# EAGLE design Photon_Proto_Shield (EAGLE 7.1.0)
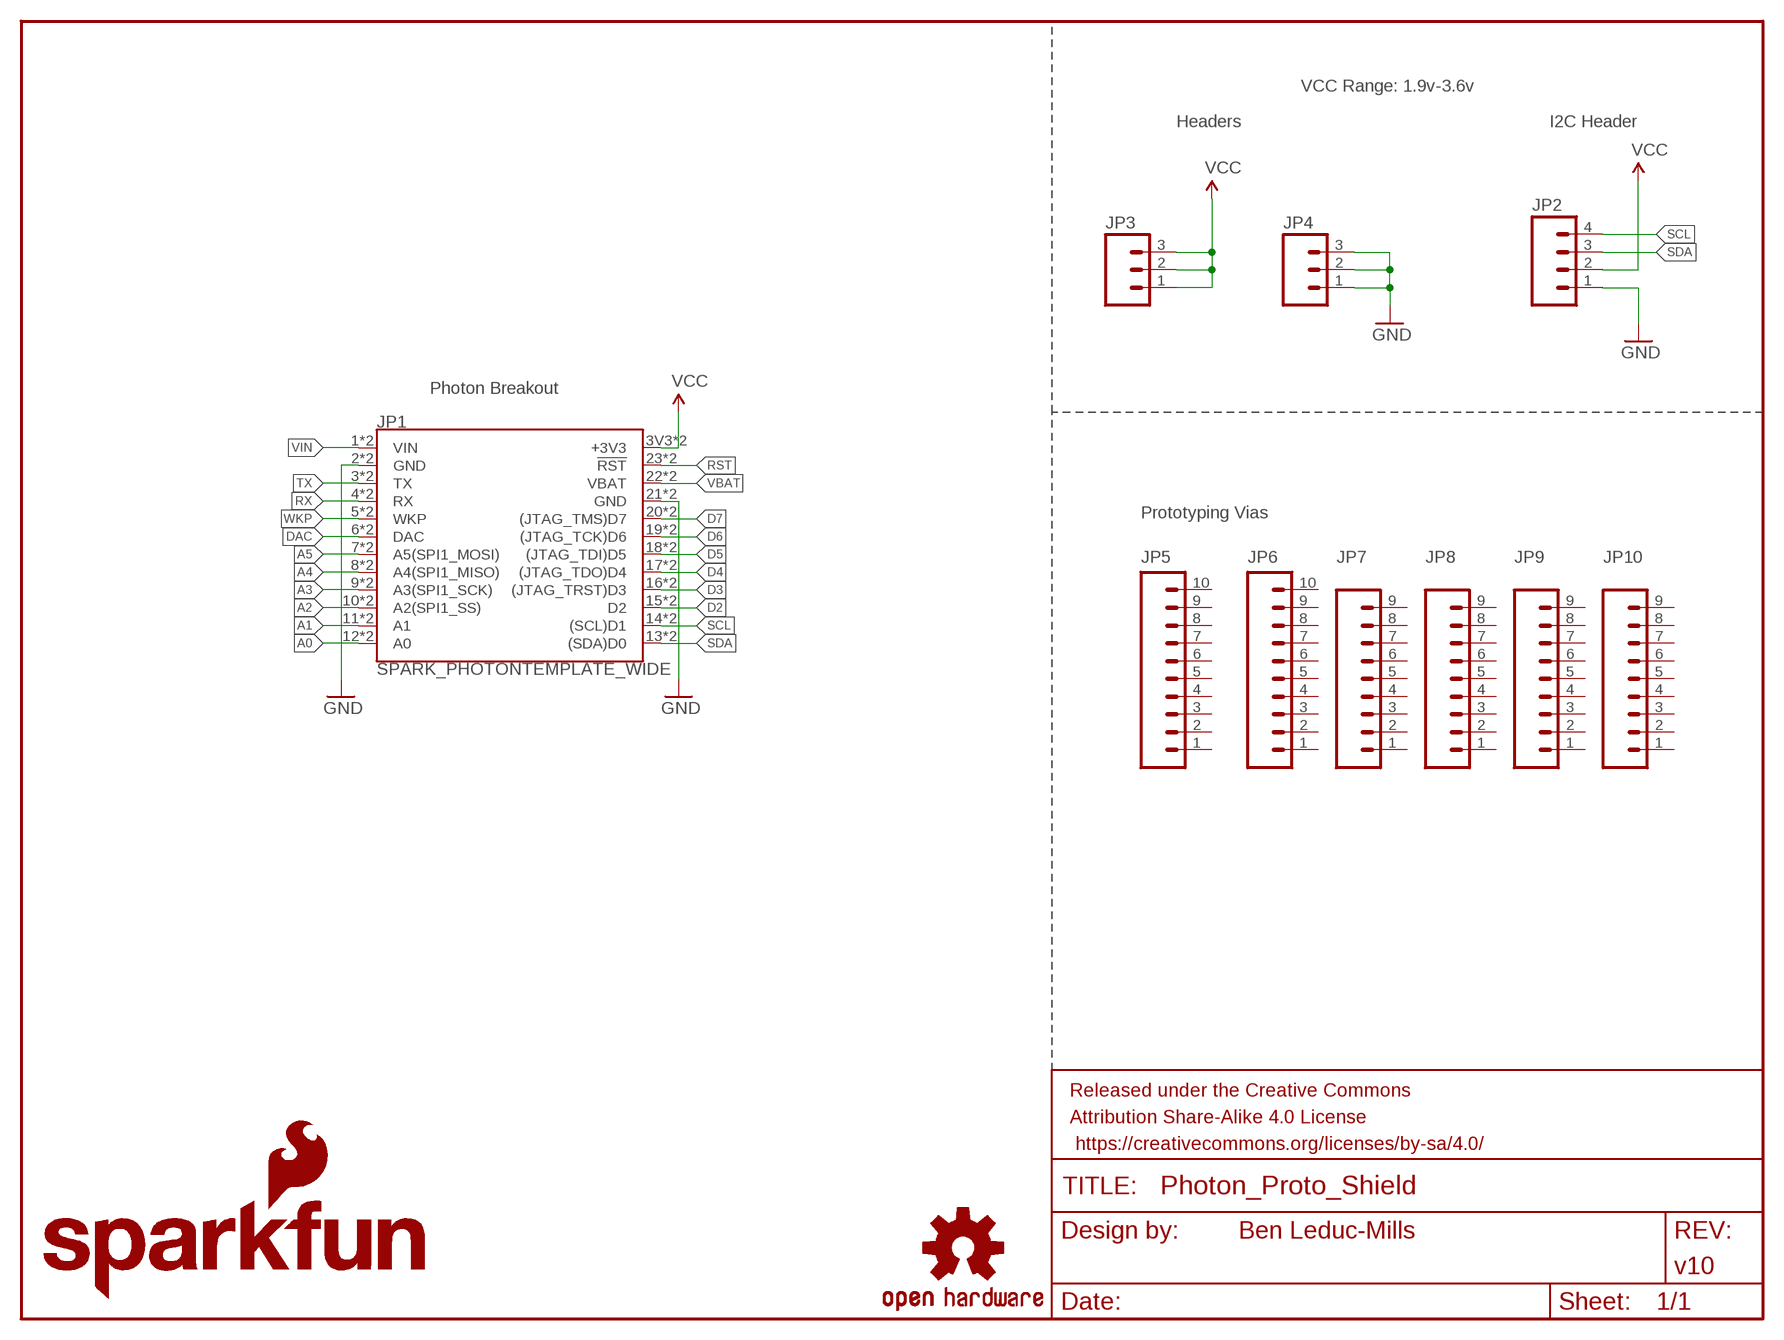
[diagram p0: schematic, sheet 1]

## Parts
FRAME1  FRAME-LETTER  [CREATIVE_COMMONS]
JP1  SPARK_PHOTONTEMPLATE_WIDE  [SPARK_PHOTON_TEMPLATE_WIDE]
JP2  M04PTH  [1X04]
JP3  M03PTH  [1X03]
JP4  M03PTH  [1X03]
JP5  M10NO_SILK_PTH_FEMALE  [1X10_NO_SILK]
JP6  M10NO_SILK_PTH_FEMALE  [1X10_NO_SILK]
JP7  M09NO_SILK  [1X09_NO_SILK]
JP8  M09NO_SILK  [1X09_NO_SILK]
JP9  M09NO_SILK  [1X09_NO_SILK]
JP10  M09NO_SILK  [1X09_NO_SILK]
LOGO1  SFE_LOGO_NAME_FLAME.1_INCH  [SFE_LOGO_NAME_FLAME_.1]
LOGO2  OSHW-LOGOS  [OSHW-LOGO-S]

## Nets
A0: JP1.12(A0) JP1.A0
A1: JP1.11(A1) JP1.A1
A2: JP1.10(A2(SPI1_SS)) JP1.A2(A2(SPI1_SS))
A3: JP1.9(A3(SPI1_SCK)) JP1.A3(A3(SPI1_SCK))
A4: JP1.8(A4(SPI1_MISO)) JP1.A4(A4(SPI1_MISO))
A5: JP1.7(A5(SPI1_MOSI)) JP1.A5(A5(SPI1_MOSI))
D2: JP1.15(D2) JP1.D2
D3: JP1.16((JTAG_TRST)D3) JP1.D3((JTAG_TRST)D3)
D4: JP1.17((JTAG_TDO)D4) JP1.D4((JTAG_TDO)D4)
D5: JP1.18((JTAG_TDI)D5) JP1.D5((JTAG_TDI)D5)
D6: JP1.19((JTAG_TCK)D6) JP1.D6((JTAG_TCK)D6)
D7: JP1.20((JTAG_TMS)D7) JP1.D7((JTAG_TMS)D7)
DAC: JP1.6(DAC) JP1.DAC
GND: JP1.2(GND) JP1.21(GND) JP1.GND@0(GND) JP1.GND@2(GND) JP2.1 JP4.1 JP4.2 JP4.3
RST: JP1.23(!RST!) JP1.RST(!RST!)
RX: JP1.4(RX) JP1.RX
SCL: JP1.14((SCL)D1) JP1.D1((SCL)D1) JP2.4
SDA: JP1.13((SDA)D0) JP1.D0((SDA)D0) JP2.3
TX: JP1.3(TX) JP1.TX
VBAT: JP1.22(VBAT) JP1.VBAT
VCC: JP1.3V3(+3V3) JP1.24(+3V3) JP2.2 JP3.1 JP3.2 JP3.3
VIN: JP1.1(VIN) JP1.VIN
WKP: JP1.5(WKP) JP1.WKP
Unconnected: JP5.1 JP5.2 JP5.3 JP5.4 JP5.5 JP5.6 JP5.7 JP5.8 JP5.9 JP5.10 JP6.1 JP6.2 JP6.3 JP6.4 JP6.5 JP6.6 JP6.7 JP6.8 JP6.9 JP6.10 JP7.1 JP7.2 JP7.3 JP7.4 JP7.5 JP7.6 JP7.7 JP7.8 JP7.9 JP8.1 JP8.2 JP8.3 JP8.4 JP8.5 JP8.6 JP8.7 JP8.8 JP8.9 JP9.1 JP9.2 JP9.3 JP9.4 JP9.5 JP9.6 JP9.7 JP9.8 JP9.9 JP10.1 JP10.2 JP10.3 JP10.4 JP10.5 JP10.6 JP10.7 JP10.8 JP10.9

## Notes on the sheet
- VCC Range: 1.9v-3.6v
- Headers | I2C Header
- Photon Breakout
- Prototyping Vias

## Library data of the parts
FRAME1 = SparkFun-Aesthetics:FRAME-LETTER: Schematic Frame Standard 8.5x11 US Letter frame; DESIGNER: Ben Leduc-Mills; VERSION: v10
JP1 = template_temp:SPARK_PHOTON
JP2 = SparkFun-Connectors:M04: Header 4 Standard 4-pin 0.1" header. Use with straight break away headers (SKU : PRT-00116), right angle break away headers (PRT-00553), swiss pins (PRT-00743), machine pins (PRT-00117), and female headers (PRT-00115). Molex polarized connector foot print use with SKU : PRT-08231 with associated crimp pins and housings. 1MM SMD Version SKU: PRT-10208
JP3 JP4 = SparkFun-Connectors:M03: Header 3 Standard 3-pin 0.1" header. Use with straight break away headers (SKU : PRT-00116), right angle break away headers (PRT-00553), swiss pins (PRT-00743), machine pins (PRT-00117), and female headers (PRT-00115). Molex polarized connector foot print use with SKU : PRT-08232 with associated crimp pins and housings.
JP5 JP6 = SparkFun-Connectors:M10: Header 10 Standard 10-pin 0.1" header. Use with straight break away headers (SKU : PRT-00116), right angle break away headers (PRT-00553), swiss pins (PRT-00743), machine pins (PRT-00117), and female headers (PRT-00115).; PROD_ID: CONN-11563
JP7-JP10 = SparkFun-Connectors:M09: Header 9 Standard 9-pin 0.1" header. Use with straight break away headers (SKU : PRT-00116), right angle break away headers (PRT-00553), swiss pins (PRT-00743), machine pins (PRT-00117), and female headers (PRT-00115).
LOGO1 = SparkFun-Aesthetics:SFE_LOGO_NAME_FLAME: SFE Logo, name and flame This is the SparkFun full logo. The logo on the schematic will always be the same size; the package variant is the height of the flame part of the logo. Default layer for the logo on the board is tSilk.
LOGO2 = SparkFun-Aesthetics:OSHW-LOGO: Open Source Hardware Logo This logo indicates the piece of hardware it is found on incorporates a OSHW license and/or adheres to the definition of open source hardware found here: http://freedomdefined.org/OSHW

## Board
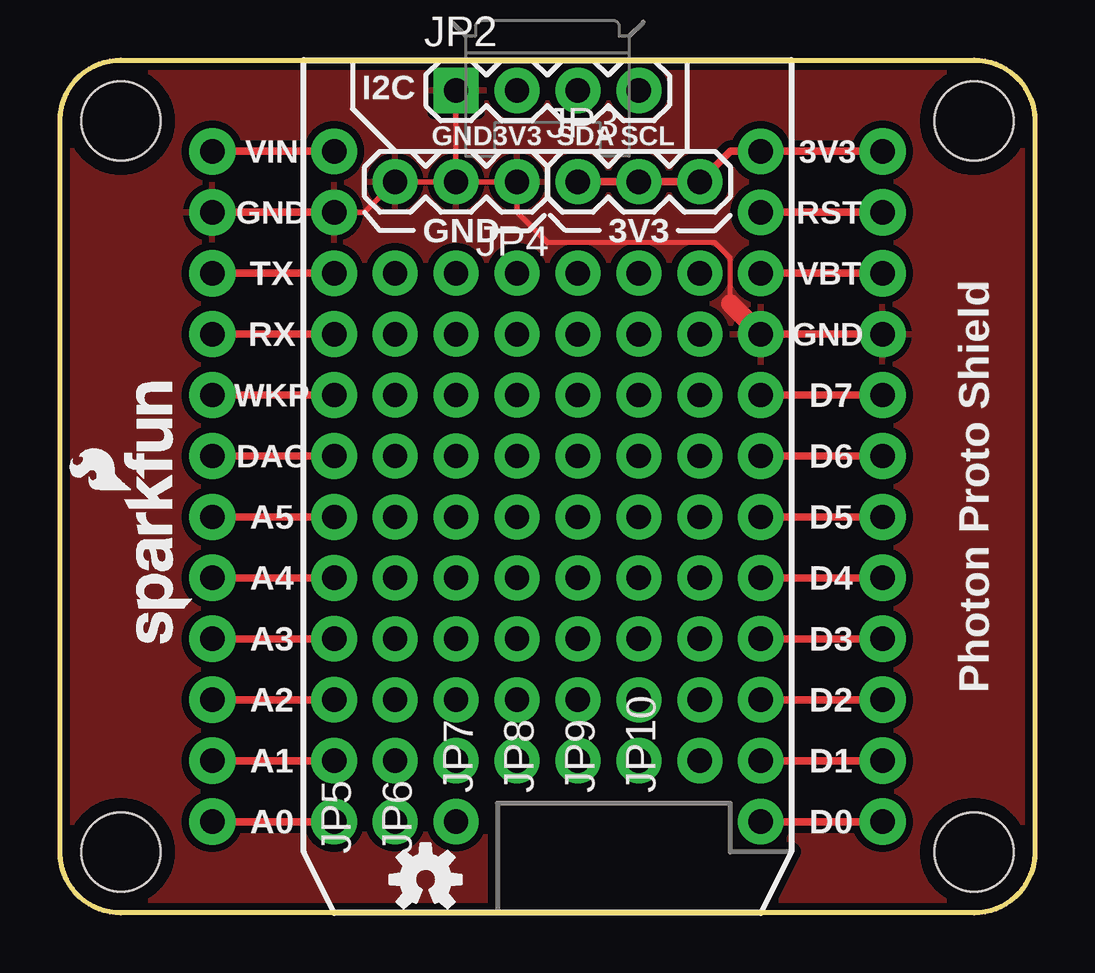
[diagram p1: board, top side]
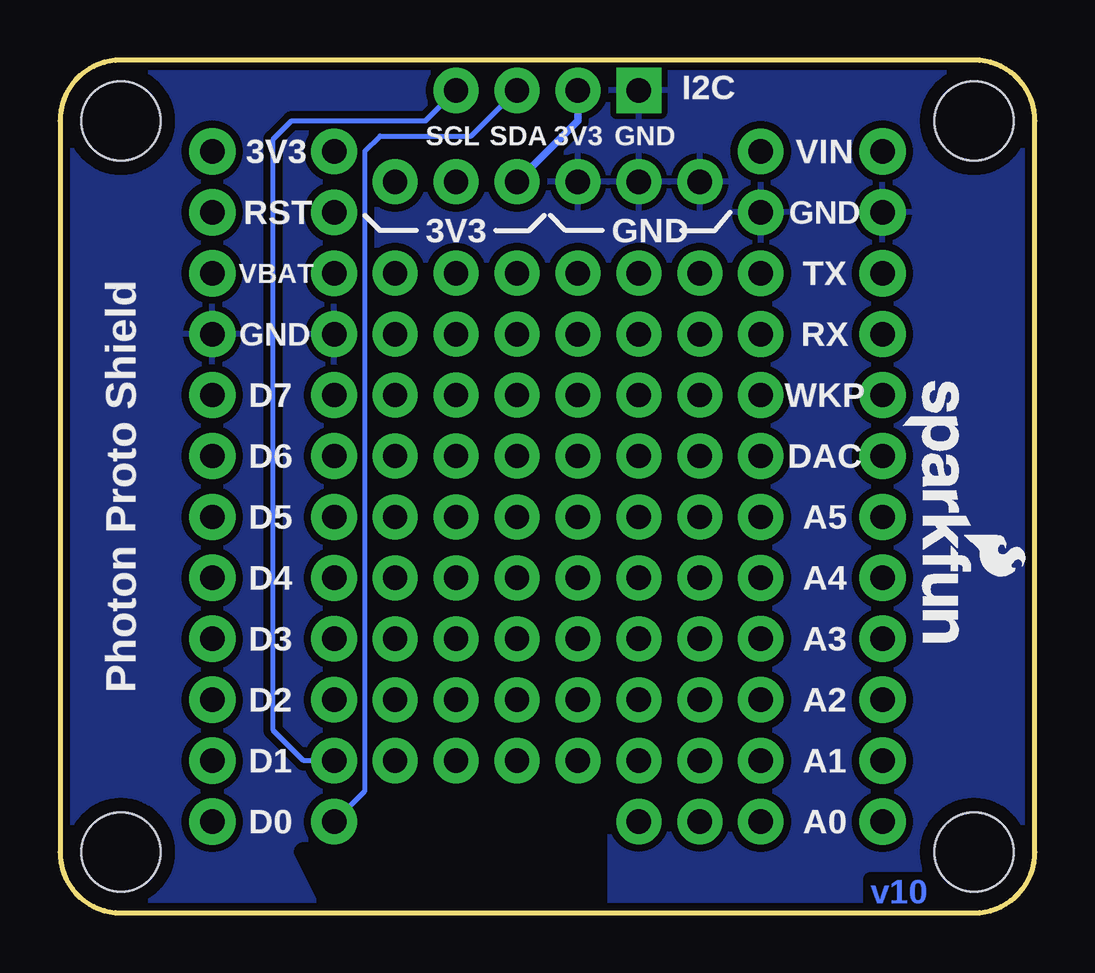
[diagram p2: board, bottom side, seen from below]

Size 40.64 x 35.56 mm. Coordinates in mm from the lower left corner, seen from the top.
Outline: 0,2.54 0,33.02 arc-90 2.54,35.56 38.1,35.56 arc-90 40.64,33.02 40.64,2.54 arc-90 38.1,0 2.54,0 arc-90 0,2.54
Copper layers (1*16): Top 0.035mm / dielectric 1.5mm / Bottom 0.035mm
Design rules "SparkFun-2-layer": minimum track width 7mil, minimum drill 15mil, track to track 8mil, track to pad 8mil, pad to pad 8mil, via to via 8mil, smd to smd 8mil, copper to edge 8mil, drill to drill 8mil, minimum pad ring 12mil, minimum via ring 10mil, stop-mask expansion 4mil, vias tented up to drill 20mil, thermal gap 10mil

### Footprints (pad centres in the part's own frame; a part is rotated, then mirrored left to right if it is on the bottom)
SPARK_PHOTON_TEMPLATE_WIDE = drill 1.016 pad 1.905: 1 1.27,31.75; 2 1.27,29.21; 3 1.27,26.67; 4 1.27,24.13; 5 1.27,21.59; 6 1.27,19.05; 7 1.27,16.51; 8 1.27,13.97; 9 1.27,11.43; 10 1.27,8.89; 11 1.27,6.35; 12 1.27,3.81; 13 19.05,3.81; 14 19.05,6.35; 15 19.05,8.89; 16 19.05,11.43; 17 19.05,13.97; 18 19.05,16.51; 19 19.05,19.05; 20 19.05,21.59; 21 19.05,24.13; 22 19.05,26.67; 23 19.05,29.21; 24 19.05,31.75 | drill 1.016 pad 1.93: 3V3 24.13,31.75; A0 -3.81,3.81; A1 -3.81,6.35; A2 -3.81,8.89; A3 -3.81,11.43; A4 -3.81,13.97; A5 -3.81,16.51; D0 24.13,3.81; D1 24.13,6.35; D2 24.13,8.89; D3 24.13,11.43; D4 24.13,13.97; D5 24.13,16.51; D6 24.13,19.05; D7 24.13,21.59; DAC -3.81,19.05; GND@0 -3.81,29.21; GND@2 24.13,24.13; RST 24.13,29.21; RX -3.81,24.13; TX -3.81,26.67; VBAT 24.13,26.67; VIN -3.81,31.75; WKP -3.81,21.59 | hole 3.302: -7.62,33.02; 27.94,33.02; -7.62,2.54; 27.94,2.54
1X04 = drill 1.016 pad 1.88 square: 1 0,0 | drill 1.016 pad 1.88: 2 2.54,0; 3 5.08,0; 4 7.62,0
1X03 = drill 1.016 pad 1.88: 1 0,0; 2 2.54,0; 3 5.08,0
1X10_NO_SILK = drill 1.016 pad 1.88: 1 0,0; 2 2.54,0; 3 5.08,0; 4 7.62,0; 5 10.16,0; 6 12.7,0; 7 15.24,0; 8 17.78,0; 9 20.32,0; 10 22.86,0
1X09_NO_SILK = drill 1.016 pad 1.88: 1 0,0; 2 2.54,0; 3 5.08,0; 4 7.62,0; 5 10.16,0; 6 12.7,0; 7 15.24,0; 8 17.78,0; 9 20.32,0

### Placement (x,y rotation side)
FRAME1  -11.43,-12.7 0 top  (outside the outline)
JP1  10.16,0 0 top
JP2  16.51,34.29 0 top
JP3  21.59,30.48 0 top
JP4  19.05,30.48 180 top
JP5  13.97,3.81 90 top
JP6  16.51,3.81 90 top
JP7  19.05,6.35 90 top
JP8  21.59,6.35 90 top
JP9  24.13,6.35 90 top
JP10  26.67,6.35 90 top
LOGO1  5.59,10.79 90 top
LOGO2  15.24,1.4 0 top
LOGO3  SFE_LOGO_NAME_FLAME.1_INCH  [SFE_LOGO_NAME_FLAME_.1]  5.59,22.61 270 bottom

### Tracks (layer width: path | path; a pad name or v marks a point on that pad's centre or on a via)
GND
  Top 0.203: JP1.2 12.7,29.21 JP4.3 JP4.2 | JP4.2 JP4.1 19.05,29.21 20.32,27.94 27.3,27.94 27.94,27.3 27.94,25.4 | JP4.2 JP2.1
  Top 0.762: JP1.21 27.94,25.4
  pour Top (isolate 0.305): 0,35.56 0,0 40.64,0 40.64,35.56
  pour Bottom (isolate 0.305): 0,35.56 0,0 40.64,0 40.64,35.56
SCL
  Bottom 0.203: JP2.4 25.4,33.02 30.99,33.02 31.75,32.26 31.75,7.62 30.48,6.35 JP1.14
SDA
  Bottom 0.203: JP1.13 27.94,5.08 27.94,31.75 27.3,32.38 23.5,32.38 JP2.3
VCC
  Top 0.305: JP1.24 27.94,31.75 JP3.3 JP3.2 JP3.1
  Bottom 0.305: JP3.1 19.05,33.02 JP2.2

### Text on the board
Bottom: v10
tPlace: I2C | GND | 3V3 | SDA | SCL | GND | 3V3 | Photon Proto Shield
bPlace: I2C | GND | 3V3 | SDA | SCL | GND | 3V3 | Photon Proto Shield
Measures: Units in Inches
tDocu: Ben Leduc-Mills